# EasyEDA Pro project ProPrj_通用工程PCB-Update-V3.1_2025-07-16.epro, board [PCB]Advance_Board
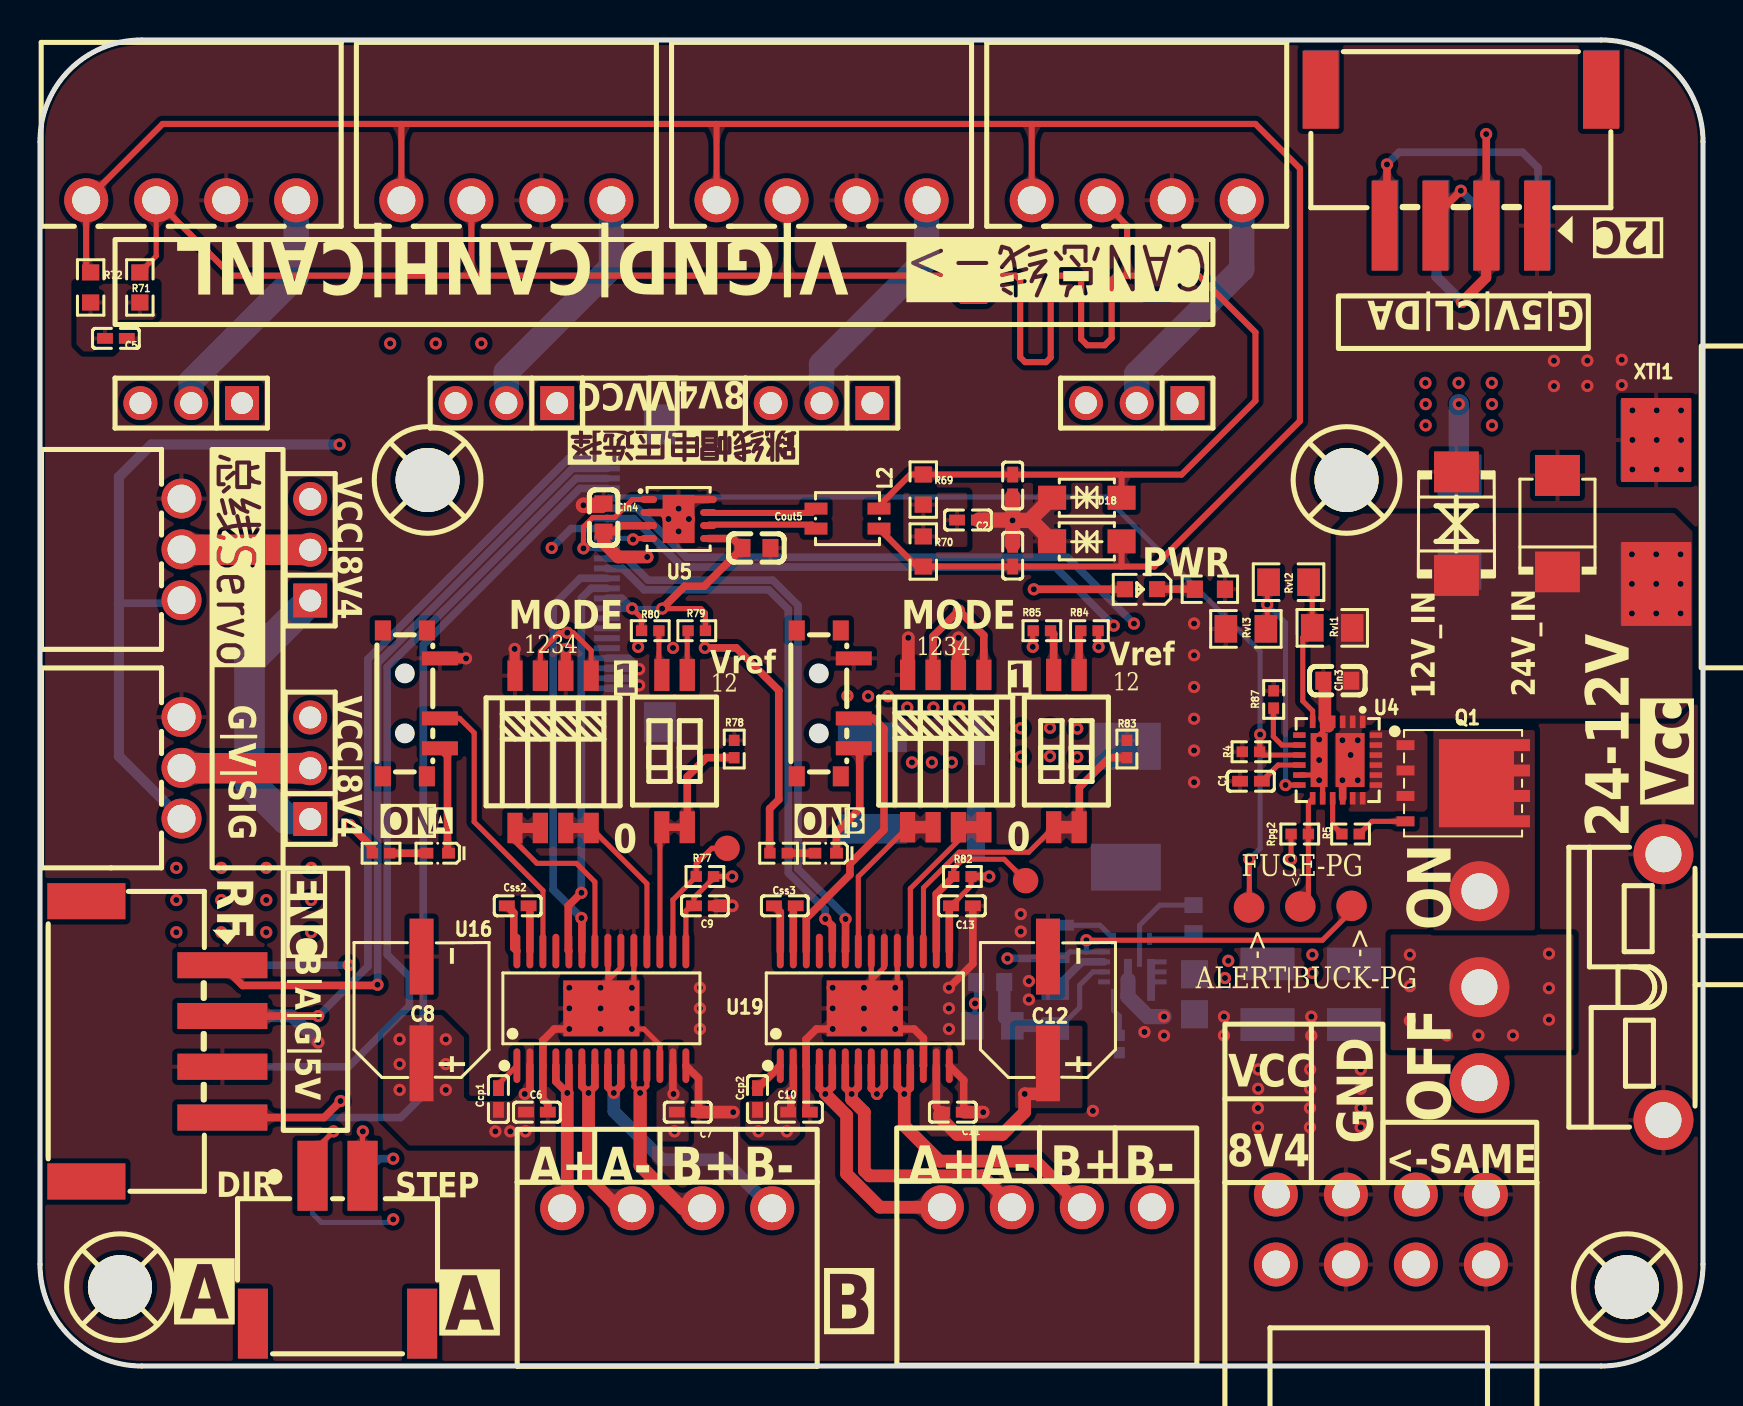
[diagram p9: board, top side]
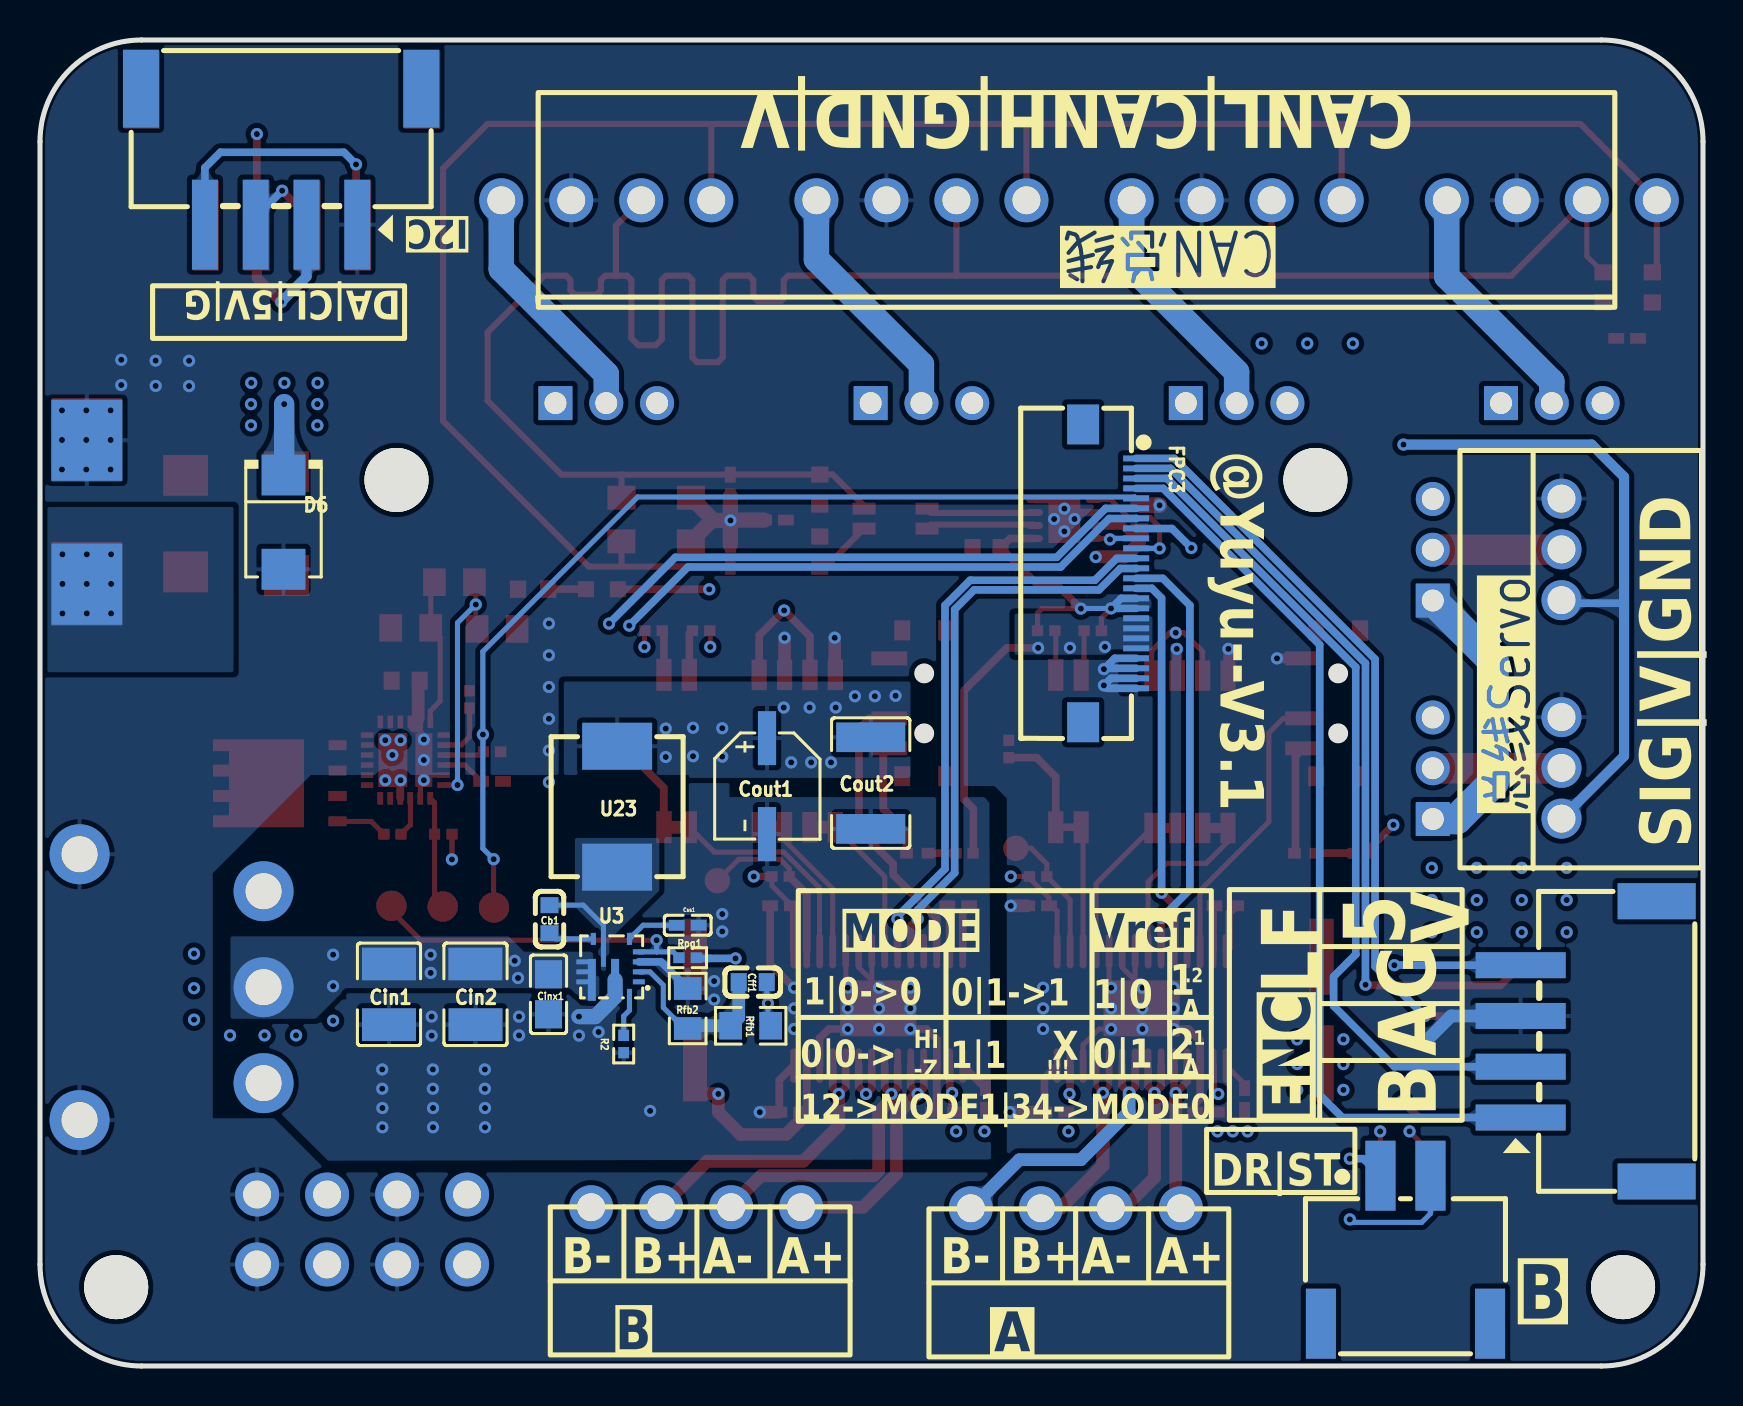
[diagram p10: board, bottom side, seen from below]

Outline 83.15 x 66.34 mm; copper layers: Top Layer, SIG, PWR, Bottom Layer. Coordinates in mm from the lower left corner of the outline.
Outline path: 0,61.26 0,5.08 arc(1.49,1.49) 5.08,0 78.07,0 arc(81.66,1.49) 83.15,5.08 83.15,61.26 arc(81.66,64.85) 78.07,66.34 5.08,66.34 arc(1.49,64.85) 0,61.26
Stack: Top Layer 0.035mm 外层铜厚1oz / Dielectric1 0.2104mm 7628 RC49% 8.6mil / SIG 0.0152mm 内层铜厚 / Dielectric2 1.065mm 1.1mm H/HOZ Copper / PWR 0.0152mm 内层铜厚 / Dielectric3 0.2104mm 7628 RC49% 8.6mil / Bottom Layer 0.035mm 外层铜厚1oz

## Design rules (mm)
net $1N15372: DP2
net $1N15395: DP2
net $1N15376: DP1
net $1N15353: DP1
template: 自定义配置
spacing copperThickness1oz (default): track to track 0.102, other pairs 0.152 to 0.3
spacing copperThickness2oz: track to track 0.203, other pairs 0.152 to 0.3
track width copperThickness1oz (default): min 0.127, default 0.254, max 2.54
track width copperThickness2oz: min 0.203, default 0.254, max 2.54
differential pair differentialPair (default): width min 0.127, default 0.254, max 2.54; gap min 0.152, default 0.152
via viaSize (default): diameter min 0.5, default 0.61, max 10; hole min 0.3, default 0.305, max 6.3
net VCC uses copperRegion1
net $1N2774 uses copperRegion1
net BAT_VCC uses copperRegion1
net 5V uses copperRegion1
net 3V3 uses copperRegion1
net $1N5506 uses copperRegion1
net FUSED_VCC uses copperRegion1

## Placement (name value [footprint] x y rotation side)
C1  2.2nF  [C0402]  60.55 29.25 180 top
C2  4.7nF  [C0402]  46.4 42.32 0 top
C3  100pF  [C0402]  48.63 44.05 90 top
C4  100pF  [C0402]  48.63 40.54 90 top
C5  4.7nF  [C0402]  3.8 51.41 0 top
C6  10nF  [C0402]  24.84 12.7 0 top
C7  10nF  [C0402]  32.38 12.7 180 top
C8  100uF  [CAP-SMD_BD6.3-L6.6-W6.6-FD-1]  19.08 17.81 90 top
C9  470nF  [C0402]  33.24 23.02 0 top
C10  10nF  [C0402]  37.95 12.7 0 top
C11  10nF  [C0402]  45.64 12.7 180 top
C12  100uF  [CAP-SMD_BD6.3-L6.6-W6.6-FD-1]  50.4 17.81 90 top
C13  470nF  [C0402]  46.1 23.02 0 top
Cb1  100nF  [C0603]  57.67 22.36 90 bottom
Ccp1  220nF  [C0402]  22.92 13.36 270 top
Ccp2  220nF  [C0402]  35.88 13.36 270 top
Cff1  100pF  [C0603]  47.51 19.21 180 bottom
Cin1  10uF  [C1210]  65.7 18.6 270 bottom
Cin2  10uF  [C1210]  61.38 18.6 270 bottom
Cin3  100nF  [C0603]  64.87 34.28 0 top
Cin4  100nF  [C0603]  28.18 42.44 90 top
Cinx1  100nF  [C0805]  57.72 18.6 270 bottom
CN3  XDWF-2500-04P  [CONN-SMD_4P-P2.54_MXXH-2.54-04P-WT1-0-A]  5.72 16.24 270 top
CN9  KF2EDGR-3.5-4P  [CONN-TH_4P-P3.50_KF2EDGR-3.5-4P]  54.84 58.32 180 top
CN10  KF2EDGR-3.5-4P  [CONN-TH_4P-P3.50_KF2EDGR-3.5-4P]  39.08 58.32 180 top
CN11  KF2EDGR-3.5-4P  [CONN-TH_4P-P3.50_KF2EDGR-3.5-4P]  23.32 58.32 180 top
CN12  KF2EDGR-3.5-4P  [CONN-TH_4P-P3.50_KF2EDGR-3.5-4P]  7.56 58.32 180 top
CN15  5264-3AW  [CONN-TH_5264-3AW]  6.38 29.92 270 top
CN16  5264-3AW  [CONN-TH_5264-3AW]  6.38 40.85 270 top
CN17  XDWF-2500-04P  [CONN-SMD_4P-P2.54_MXXH-2.54-04P-WT1-0-A]  71.04 60.45 180 top
CN18  XDWF-2500-04P  [CONN-SMD_4P-P2.54_MXXH-2.54-04P-WT1-0-A]  71.09 60.5 0 bottom
CN19  KF2EDGR-3.5-4P  [CONN-TH_4P-P3.50_KF2EDGR-3.5-4P]  31.36 7.89 0 top
CN20  KF2EDGR-3.5-4P  [CONN-TH_4P-P3.50_KF2EDGR-3.5-4P]  50.34 7.94 0 top
CN21  XDWF-2500-04P  [CONN-SMD_4P-P2.54_MXXH-2.54-04P-WT1-0-A]  5.72 16.24 90 bottom
CN22  ZX-XH2.54-2PWT  [CONN-SMD_2P-P2.54_MEGASTAR_ZX-XH2.54-2PWT]  14.88 5.82 0 top
CN23  ZX-XH2.54-2PWT  [CONN-SMD_2P-P2.54_MEGASTAR_ZX-XH2.54-2PWT]  14.88 5.82 180 bottom
CN24  KF2EDGKRH-3.5-2*4P  [CONN-TH_8P-P3.50_KEFA_KF2EDGKRH-3.5-2-4P]  67.05 6.83 0 top
Cout1  33uF  [CAP-SMD_BD5.0-L5.3-W5.3-LS6.3-FD]  46.8 29.01 270 bottom
Cout2  15uF  [C1812]  41.61 29.16 90 bottom
Cout5  100nF  [C0603]  35.82 40.92 180 top
Css1  22nF  [C0402]  50.77 22.05 180 bottom
Css2  22nF  [C0402]  23.88 23.02 0 top
Css3  22nF  [C0402]  37.24 23.02 0 top
D4  SMBJ15CA  [SMB_L4.6-W3.6-LS5.4-BI]  70.82 42.14 270 top
D5  SMBJ26CA  [SMB_L4.6-W3.6-LS5.4-RD]  75.87 42.14 90 top
D6  SMBJ9.0A  [SMB_L4.6-W3.6-LS5.3-RD]  70.97 42.22 270 bottom
D18  SMF5.0CA  [SOD-123FL_L2.7-W1.8-LS3.8-BI]  52.34 43.44 180 top
D19  SMF5.0CA  [SOD-123FL_L2.7-W1.8-LS3.8-BI]  52.34 41.25 0 top
FPC3  AFC01-S24FCA-00  [FPC-SMD_24P-P0.50_AFC01-S24FCA-00]  29.67 39.65 270 bottom
H3  -  [HDR-TH_3P-P2.54-V-M]  13.51 29.9 90 top
H4  -  [HDR-TH_3P-P2.54-V-M]  13.51 40.83 90 top
H5  -  [HDR-TH_3P-P2.54-V-M]  54.84 48.17 180 top
H6  -  [HDR-TH_3P-P2.54-V-M]  39.08 48.17 180 top
H7  -  [HDR-TH_3P-P2.54-V-M]  23.32 48.17 180 top
H8  -  [HDR-TH_3P-P2.54-V-M]  7.56 48.17 180 top
L2  ACT1210-510-2P-TL00  [FILTER-SMD_4P-L3.2-W2.5-BL_ACT1210]  40.37 42.39 270 top
LED1  LTST-C191KSKT  [LED0603-RD-YELLOW]  55.05 38.86 180 top
LED2  -  [LED_0402]  19.89 25.65 180 top
LED3  -  [LED_0402]  39.29 25.65 180 top
NOREF  -  [Pad_e1979]  80.81 46.31 0 top
NOREF#2  -  [Pad_e1977]  80.81 39.11 0 top
Q1  BSC0702LS-HXY  [TDSON-8_L5.9-W5.2-P1.27-BL]  70.05 29.15 270 top
R2  52.3kΩ  [R0402]  53.97 16.11 270 bottom
R4  1kΩ  [R0402]  60.55 30.73 0 top
R5  1K  [R0402]  65.53 26.61 0 top
R67  10K  [R0603]  58.49 38.86 0 top
R69  60R  [R0603]  44.16 43.84 90 top
R70  60R  [R0603]  44.16 40.75 90 top
R71  60R  [R0603]  4.99 53.96 90 top
R72  60R  [R0603]  2.53 53.96 270 top
R77  10K  [R0402]  33.24 24.49 0 top
R78  28K  [R0402]  34.71 30.86 270 top
R79  5K  [R0402]  32.84 36.79 0 top
R80  28K  [R0402]  30.51 36.79 0 top
R81  10K  [R0402]  17.05 25.65 0 top
R82  10K  [R0402]  46.12 24.49 0 top
R83  28K  [R0402]  54.34 30.86 270 top
R84  5K  [R0402]  52.47 36.79 0 top
R85  28K  [R0402]  50.09 36.79 0 top
R86  10K  [R0402]  36.93 25.65 0 top
R87  105Ω  [R0402]  61.68 33.34 270 top
Rfb1  130K  [R0805]  47.62 17.02 0 bottom
Rfb2  10K  [R0805]  50.77 17.88 270 bottom
Rpg1  100kΩ  [R0402]  50.77 20.42 0 bottom
Rpg2  100kΩ  [R0402]  62.99 26.61 180 top
Rvl1  1M  [R0805]  64.61 36.93 180 top
Rvl2  41.2K  [R0805]  62.43 39.21 0 top
Rvl3  84.5K  [R0805]  60.29 36.88 0 top
SCREW1  -  [M3螺丝]  65.33 44.32 0 top
SCREW2  -  [M3螺丝]  19.38 44.32 0 top
SCREW3  -  [M3螺丝]  79.34 3.95 0 top
SCREW4  -  [M3螺丝]  4 3.95 0 top
SW1  SS-12D11G5R  [SW-TH_SS-12D11G5R]  76.57 18.95 270 top
SW2  DSHP02TS-S  [SW-SMD_DSHP02TS-S]  31.73 30.76 0 top
SW3  DSHP02TS-S  [SW-SMD_DSHP02TS-S]  51.32 30.76 0 top
TP1  -  [Test-Point-0.5mm#3]  65.58 23.02 180 bottom
TP2  -  [Test-Point-0.5mm#2]  60.45 22.94 0 top
TP3  -  [Test-Point-0.5mm#2]  63.02 22.99 90 top
TP4  -  [Test-Point-0.5mm]  34.35 25.9 0 top
TP5  -  [Test-Point-0.5mm]  49.28 24.28 0 top
U3  TPS56A37RPAR  [VQFN-HR-10_L3.0-W3.0_TI_RPA]  54.52 19.97 90 bottom
U4  TPS259830LNRGER  [VQFN-24_L4.0-W4.0-P0.50-TL-EP_TI_RGE]  64.88 30.31 270 top
U5  TCAN1044AVDRBRQ1  [TDFN-8_L3.0-W3.0-P0.65-BL-EP]  31.93 42.37 270 top
U16  DRV8424PWPR  [HTSSOP-28_L9.7-W4.4-P0.65-LS6.4-BL-EP3.8]  28.07 17.89 0 top
U17  DSHP04TSGER  [SW-SMD_8P-L6.7-W5.4-P1.27-LS8.4]  25.65 30.73 180 top
U18  MSS12C02LS-BB2.0  [SW-SMD_MSS12C02LS-HB2.0-1]  18.57 33.15 90 top
U19  DRV8424PWPR  [HTSSOP-28_L9.7-W4.4-P0.65-LS6.4-BL-EP3.8]  41.24 17.89 0 top
U20  DSHP04TSGER  [SW-SMD_8P-L6.7-W5.4-P1.27-LS8.4]  45.29 30.76 180 top
U21  MSS12C02LS-BB2.0  [SW-SMD_MSS12C02LS-HB2.0-1]  39.27 33.15 90 top
U23  4.7uH  [IND-SMD_L7.0-W6.6_APH0630]  54.29 27.98 90 bottom
XTI1  -  [XT60PW]  79.06 42.73 0 top

## Footprints (pads in the part's own frame, mm; a bottom-side part is the same pattern mirrored in y, then rotated)
C0402
  rect 0.79x0.54 smd: 1(-0.545,0) 2(0.545,0)
C0603
  rect 0.8x0.9 smd: 1(-0.7,0) 2(0.7,0)
C0805
  rect 1.41x1.35 smd: 1(-1,0) 2(1,0)
C1210
  rect 1.635x2.7 smd: 1(-1.518,0) 2(1.518,0)
C1812
  rect 1.485x3.456 smd: 1(-2.292,0) 2(2.292,0)
CAP-SMD_BD5.0-L5.3-W5.3-LS6.3-FD
  rect 2.7x0.91 smd: 1(-2.4,0) 2(2.4,0)
CAP-SMD_BD6.3-L6.6-W6.6-FD-1
  rect 3.8x1.2 smd: 1(-2.67,0) 2(2.67,0)
CONN-SMD_2P-P2.54_MEGASTAR_ZX-XH2.54-2PWT
  rect 1.5x3.5 smd: 1(-1.25,3.7) 2(1.25,3.7) 3(-4.23,-3.7) 4(4.23,-3.7)
CONN-SMD_4P-P2.54_MXXH-2.54-04P-WT1-0-A
  rect 1.3x4.5 smd: 1(-3.809,3.4) 2(-1.27,3.4) 3(1.27,3.4) 4(3.81,3.4)
  rect 1.8x3.9 smd: 5(7.01,-3.4) 6(-7.01,-3.4)
CONN-TH_4P-P3.50_KF2EDGR-3.5-4P
  round 2.2 hole 1.4: 1(-5.25,0) 2(-1.75,0) 3(1.75,0) 4(5.25,0)
CONN-TH_8P-P3.50_KEFA_KF2EDGKRH-3.5-2-4P
  round 2.2 hole 1.4: 1(-5.25,-1.75) 2(-5.25,1.75) 3(-1.75,-1.75) 4(-1.75,1.75) 5(1.75,-1.75) 6(1.75,1.75) 7(5.25,-1.75) 8(5.25,1.75)
CONN-TH_5264-3AW
  round 2 hole 1.4: 1(2.54,0.7) 2(0,0.7) 3(-2.54,0.7)
FILTER-SMD_4P-L3.2-W2.5-BL_ACT1210
  rect 0.6x1.15 smd: 1(-0.5,-1.575) 2(0.5,-1.575) 3(0.5,1.575) 4(-0.5,1.575)
FPC-SMD_24P-P0.50_AFC01-S24FCA-00
  rect 0.3x1.3 smd: 1(-5.75,1.325) 2(-5.25,1.325) 3(-4.75,1.325) 4(-4.25,1.325) 5(-3.75,1.325) 6(-3.25,1.325) 7(-2.75,1.325) 8(-2.25,1.325) 9(-1.75,1.325) 10(-1.25,1.325) 11(-0.75,1.325) 12(-0.25,1.325) 13(0.25,1.325) 14(0.75,1.325) 15(1.25,1.325) 16(1.75,1.325) 17(2.25,1.325) 18(2.75,1.325) 19(3.25,1.325) 20(3.75,1.325) 21(4.25,1.325) 22(4.75,1.325) 23(5.25,1.325) 24(5.75,1.325)
  rect 2x1.6 smd: 25(7.449,-1.325) 26(-7.45,-1.325)
HDR-TH_3P-P2.54-V-M
  rect 1.7x1.7 hole 1.1: 1(-2.54,0)
  round 1.7 hole 1.1: 2(0,0) 3(2.54,0)
HTSSOP-28_L9.7-W4.4-P0.65-LS6.4-BL-EP3.8
  oval 0.343x1.732 smd: 1(-4.225,-2.866) 2(-3.575,-2.866) 3(-2.925,-2.866) 4(-2.275,-2.866) 5(-1.625,-2.866) 6(-0.975,-2.866) 7(-0.325,-2.866) 8(0.325,-2.866) 9(0.975,-2.866) 10(1.625,-2.866) 11(2.275,-2.866) 12(2.925,-2.866) 13(3.575,-2.866) 14(4.225,-2.866) 15(4.225,2.866) 16(3.575,2.866) 17(2.925,2.866) 18(2.275,2.866) 19(1.625,2.866) 20(0.975,2.866) 21(0.325,2.866) 22(-0.325,2.866) 23(-0.975,2.866) 24(-1.625,2.866) 25(-2.275,2.866) 26(-2.925,2.866) 27(-3.575,2.866) 28(-4.225,2.866)
  rect 3.81x2.8 smd: 29(0,0)
IND-SMD_L7.0-W6.6_APH0630
  rect 2.35x3.5 smd: 1(-3.025,0) 2(3.025,0)
LED0603-RD-YELLOW
  rect 0.8x0.8 smd: 1(-0.799,-0.004) 2(0.799,0.004)
LED_0402
  rect 0.637x0.541 smd: 1(-0.538,0) 2(0.538,0)
M3螺丝
  round 3.2 hole 3.2: 1(0,0)
Pad_e1977
  rect 3.556x4.064 smd far side: 1(0,0)
Pad_e1979
  rect 3.556x4.064 smd far side: 1(0,0)
R0402
  rect 0.566x0.54 smd: 1(-0.433,0) 2(0.433,0)
R0603
  rect 0.806x0.864 smd: 1(-0.753,0) 2(0.753,0)
R0805
  rect 1.133x1.377 smd: 1(-1,0) 2(1,0)
SMB_L4.6-W3.6-LS5.3-RD
  rect 2.047x2.192 smd: 1(-2.361,0) 2(2.361,0)
SMB_L4.6-W3.6-LS5.4-BI
  rect 2.047x2.241 smd: 1(-2.591,0) 2(2.591,0)
SMB_L4.6-W3.6-LS5.4-RD
  rect 2.047x2.241 smd: 1(-2.413,0) 2(2.413,0)
SOD-123FL_L2.7-W1.8-LS3.8-BI
  rect 1.4x1.2 smd: 1(-1.735,0) 2(1.735,0)
SW-SMD_8P-L6.7-W5.4-P1.27-LS8.4
  rect 0.762x1.524 smd: 1(-1.905,-3.81) 2(-0.635,-3.81) 3(0.635,-3.81) 4(1.905,-3.81) 5(1.905,3.81) 6(0.635,3.81) 7(-0.635,3.81) 8(-1.905,3.81)
SW-SMD_DSHP02TS-S
  rect 0.762x1.6 smd: 1(0.635,3.81) 2(-0.635,3.81) 3(-0.635,-3.81) 4(0.635,-3.81)
SW-SMD_MSS12C02LS-HB2.0-1
  rect 0.7x1.8 smd: 1(-2.25,-1.425) 2(-0.75,-1.425) 3(2.25,-1.425)
  rect 1x0.8 smd: 4(-3.65,1.425) 4(-3.65,-0.775) 4(3.65,1.425) 4(3.65,-0.775)
SW-TH_SS-12D11G5R
  round 3 hole 1.8: 1(-4.8,-4.6) 2(0,-4.6) 3(4.8,-4.6) 4(6.65,4.6) 5(-6.65,4.6)
TDFN-8_L3.0-W3.0-P0.65-BL-EP
  oval 0.35x0.84 smd: 1(-0.975,-1.495) 2(-0.325,-1.495) 3(0.325,-1.495) 4(0.975,-1.495) 5(0.975,1.495) 6(0.325,1.495) 7(-0.325,1.495) 8(-0.975,1.495)
  rect 2.4x1.6 smd: 9(0,0)
TDSON-8_L5.9-W5.2-P1.27-BL
  rect 0.5x0.9 smd: 1(-1.905,-1.775) 2(-0.635,-1.775) 3(0.635,-1.775) 4(1.905,-1.775)
  custom 4.41x4.55 smd: 5(0,1.775)
Test-Point-0.5mm
  round 1.27 smd: 1(0,0)
Test-Point-0.5mm#2
  round 1.524 smd: 1(0,0)
Test-Point-0.5mm#3
  round 1.524 smd far side: 1(0,0)
VQFN-24_L4.0-W4.0-P0.50-TL-EP_TI_RGE
  rect 0.625x0.28 smd: 1(-1.913,1.25) 2(-1.913,0.75) 3(-1.913,0.25) 4(-1.913,-0.25) 5(-1.913,-0.75) 6(-1.913,-1.25) 13(1.913,-1.25) 14(1.913,-0.75) 15(1.913,-0.25) 16(1.913,0.25) 17(1.913,0.75) 18(1.913,1.25)
  rect 0.28x0.625 smd: 7(-1.25,-1.913) 8(-0.75,-1.913) 9(-0.25,-1.913) 10(0.25,-1.913) 11(0.75,-1.913) 12(1.25,-1.913) 19(1.25,1.913) 20(0.75,1.913) 21(0.25,1.913) 22(-0.25,1.913) 23(-0.75,1.913) 24(-1.25,1.913)
  rect 2.7x1.45 smd: 25(0,0.625)
  rect 2.7x0.85 smd: 26(0,-0.925)
VQFN-HR-10_L3.0-W3.0_TI_RPA
  rect 0.25x0.6 smd: 1(-0.75,-1.317) 2(-0.25,-1.317) 3(0.25,-1.317) 4(0.75,-1.317)
  rect 0.6x0.25 smd: 5(1.4,-0.848) 7(1.4,0.953) 10(-1.4,-0.848)
  rect 1.7x0.25 smd: 6(0.85,0.453)
  custom 2.1x0.97 smd: 8(-0.65,1.317)
  rect 2.1x0.4 smd: 9(-0.65,-0.128)
XT60PW
  custom 3.5x4.2 smd: 1(1.75,-3.6) 2(1.75,3.6)

## Nets
As in the schematic, except:
GND: C1.2 C2.2 C3.1 C4.2 C5.2 C6.2 C7.1 C8.2 C9.2 C10.2 C11.1 C12.2 C13.2 Cin1.2 Cin2.2 Cin3.1 Cin4.2 Cinx1.2 CN3.3 CN9.2 CN10.2 CN11.2 CN12.2 CN15.3 CN16.3 CN17.1 CN18.1 CN21.3 CN24.3 CN24.4 CN24.7 CN24.8 Cout1.2 Cout2.1 Cout5.1 Css1.2 D4.1 D5.2 D6.2 D18.2 D19.1 FPC3.21 FPC3.22 FPC3.23 FPC3.24 NOREF.1 R2.2 R4.1 R67.2 R78.1 R83.1 R87.1 Rfb2.1 Rvl3.1 SW1.4 SW1.5 U3.3 U3.9 U4.4 U4.5 U4.11 U4.14 U4.26 U5.2 U5.8 U5.9 U16.3 U16.12 U16.14 U16.19 U16.20 U16.21 U16.29 U17.2 U17.4 U18.3 U19.3 U19.12 U19.14 U19.19 U19.20 U19.21 U19.29 U20.2 U20.4 U21.3 XTI1.2
BAT_VCC: Cin3.2 D4.2 D5.1 NOREF#2.1 Rvl1.1 U4.1 U4.2 U4.3 U4.16 U4.25 XTI1.1

Pads without a net: CN3 5 6; CN17 5 6; CN18 5 6; CN21 5 6; CN22 3 4; CN23 3 4; FPC3 25 26; SCREW1 1; SCREW2 1; SCREW3 1; SCREW4 1; SW1 3; U3 1; U4 7; U16 25; U18 4; U19 25; U21 4

## Via types
v1: diameter 0.61, hole 0.305, Top Layer to Bottom Layer, 222 vias

## Routing (per net, layer and track width the routed paths; a pad name or vN(x,y) marks a point on that pad's centre or on a via; arc(x,y) is an arc through that point)
3V3: length 58.8
  Top Layer w0.254: R85.1 49.64,36.76 v1(49.64,35.98) ; v1(29.6,37.9) 30.08,37.42 R80.1 ; v1(52.93,35.98) 52.93,36.76 R84.2 ; Rpg2.2 v1(62.55,25.34) ; R79.2 33.27,37.67 33.05,37.89 v1(31.11,37.89)
  Top Layer w0.381: U5.5 34.65,41.4 Cout5.2 33.21,39.01 32.23,39.01 v1(31.11,37.89)
  SIG w0.508: v1(62.55,25.34) 61.74,26.16 57.89,26.16 55.81,28.23 55.81,33.09 v1(52.93,35.98) v1(49.64,35.98) 47.11,38.51 40.08,38.51 39.46,37.89 v1(31.11,37.89)
  Bottom Layer w0.254: v1(31.11,37.89) 31.1,37.9 v1(29.6,37.9)
  Bottom Layer w0.381: 29.6,37.9 29.1,38.4 FPC3.15 ; 29.6,37.9 FPC3.16 ; 29.6,37.9 v1(29.6,37.9)
5V: length 182.6
  Top Layer w0.381: Cin4.1 28.72,41.74 29.01,42.03 30.42,42.03 U5.3 ; v1(15.48,27.07) 16.62,25.94 R81.1 ; v1(15.03,13.26) 14.2,12.43 CN3.4 ; CN17.2 72.31,61.63 v1(72.31,61.63) ; R86.1 36.48,25.67 36.48,27.88 36.94,28.33 36.94,33.8 34.81,35.92 v1(33.24,35.92)
  Top Layer w0.508: v1(71.09,53.23) 72.31,54.44 72.31,57.04 CN17.2
  Top Layer w0.635: v1(30.36,40.47) 28.9,40.47 28.18,41.19 Cin4.1
  SIG w0.381: v1(31.65,35.92) 32.31,36.58 35.07,36.58 37.55,34.1 37.55,29.35 46.1,20.8 46.1,17.03 46.48,16.65 47.99,16.65 48.37,17.03 v1(48.37,20.39) ; v1(72.31,61.63) 67.4,61.63 63.71,57.94 63.71,51.27 58.03,45.59 31.32,45.59 30.36,44.63 v1(30.36,40.47) 30.36,36.43 v1(29.9,35.98)
  SIG w0.762: v1(29.9,35.98) 27.98,37.9 17.2,37.9 15.47,36.17 15.47,13.7 v1(15.03,13.26)
  Bottom Layer w0.381: CN21.4 v1(15.43,20.05) ; v1(48.37,20.39) 50.3,20.39 Rpg1.1
  Bottom Layer w0.508: v1(71.09,53.23) 69.82,54.5 CN18.2
8V4: length 112.5
  Top Layer w0.381: LED1.2 v1(49.69,38.86)
  SIG w0.254: v1(46.75,18.14) 46.75,22.11 49.04,24.39 v1(49.04,30.48)
  SIG w0.762: CN24.5 68.85,5.03 68.85,1.82
  SIG w0.838: v1(69.28,47.06) 70.35,48.12 ; 70.35,48.12 70.93,48.12 ; 70.35,48.12 70.33,48.12 ; v1(72.6,47.06) v1(72.6,48.12) 72.59,48.13 v1(72.59,49.18) ; 70.33,48.12 v1(69.27,49.18) ; 70.33,48.12 v1(69.28,48.12) ; 70.93,48.13 v1(70.93,49.18)
  SIG w1.524: CN24.1 65.05,1.82 71.88,1.82 76.67,6.6 76.67,44.92 73.47,48.12 v1(72.6,48.12) v1(70.94,48.12)
  Bottom Layer w0.254: Rfb1.1 46.75,17.16 v1(46.75,18.14) 46.81,18.2 46.81,19.21
  Bottom Layer w1.016: 70.97,44.58 70.94,44.61 v1(70.94,48.12)
  Bottom Layer w1.524: H4.1 10.47,35.26 10.47,29.2 12.31,27.36 H3.1
  vias: v1(40.37,33.53) v1(41.41,33.51) v1(42.4,33.51) v1(43.36,32.94) v1(43.6,30.2) v1(44.59,30.2) v1(44.67,32.94) v1(45.59,30.2) v1(45.96,32.94) v1(49.04,31.91) v1(50.5,31.93) v1(50.5,30.51) v1(51.86,31.89) v1(51.86,30.47)
DVDD1: length 26.7
  Top Layer w0.254: U17.3 25.02,35.75 25.96,36.68 v1(26.36,36.68) 26.67,36.68 27.56,35.79 U17.1 ; v1(34.61,24.49) R77.2 33.68,24.41 32.7,23.43 C9.1 32.55,23.02 32.3,22.77 U16.15
  SIG w0.254: v1(34.61,24.49) 34.61,28.44 v1(26.36,36.68)
DVDD2: length 27
  Top Layer w0.254: 45.55,23.02 46.55,24.02 R82.2
  Top Layer w0.381: U19.15 45.46,22.93 45.55,23.02 ; U20.1 47.19,36.55 v1(45.94,37.8) 44.65,36.5 U20.3 ; R82.2 v1(47.46,24.49)
  SIG w0.381: v1(45.94,37.8) 48.02,35.72 48.02,25.05 v1(47.46,24.49)
GND: length 101.9
  Top Layer w0.254: v1(42.76,18.92) 42.86,19.03 U19.19 ; U16.21 28.4,19.29 29.05,19.94 U16.20 ; 64.13,31.77 64.41,32.05 64.59,32.23 U4.4 ; 64.13,31.77 64.15,31.75 63.96,31.55 v1(63.96,31.34) ; 64.13,31.77 64.13,32.01 ; U16.19 29.69,19.03 v1(29.59,18.92) ; U19.21 41.56,19.29 42.21,19.94 42.21,20.76 ; U16.12 31,16.06 30.2,16.86 v1(29.59,16.86) ; U4.11 63.7,29.56 v1(63.96,29.31) 64.13,29.13 U4.14
  Top Layer w0.381: v1(31.43,42.37) 31.1,42.7 U5.2 ; C6.2 25.39,13.12 25.15,13.36 U16.3 25.15,16.29 25.72,16.86 v1(26.46,16.86) ; U5.8 32.39,43.35 v1(31.93,42.89) ; C7.1 32.93,14.39 U16.14 ; U19.12 44.17,15.04 44.17,16.39 43.71,16.86 v1(42.76,16.86) ; v1(39.63,16.86) 38.82,16.86 38.3,16.34 38.3,15.04 U19.3 38.31,12.88 C10.2 ; v1(45.45,18.92) 46.64,20.12 C13.2 ; C11.1 46.19,14.3 U19.14
  Top Layer w0.508: U17.4 23.73,34.55 v1(23.73,35.87) ; U18.3 v1(21.3,35.4) ; v1(26.31,35.87) 26.29,35.85 U17.2
  Top Layer w0.635: U20.4 43.42,34.61 v1(43.42,36.43) ; C7.1 v1(34.66,12.7) ; 64.41,32.01 64.41,32.23 64.24,32.4 64.24,34.21 Cin3.1 ; C11.1 v1(47.16,12.7) ; v1(45.92,36.43) U20.2 ; C9.2 v1(34.61,23.02)
  Top Layer w0.762: C2.2 48.61,42.32 v1(48.63,42.3) ; v1(48.63,42.3) 48.63,42.31 48.63,43.5 ; v1(48.63,42.3) 48.63,42.29 C4.2 ; v1(48.63,42.3) 49.47,42.3 ; v1(27.17,43.06) 27.18,43.06 28.1,43.06 Cin4.2 ; 49.47,42.3 49.56,42.3 D19.1 ; 49.47,42.3 D18.2
  SIG w0.508: v1(33,18.92) v1(29.59,18.92) ; v1(45.45,16.86) v1(42.76,16.86) ; v1(45.45,17.89) v1(42.76,17.89) ; v1(45.45,18.92) v1(42.76,18.92) ; v1(33,17.89) v1(29.59,17.89) ; v1(33,16.86) v1(29.59,16.86)
  Bottom Layer w0.381: Rfb2.1 52.1,20.22 53.21,20.22 ; FPC3.23 29.6,34.4 v1(29.96,34.05) 29.81,33.9 FPC3.24 ; 29.91,34.9 29.41,35.4 FPC3.21 ; 29.91,34.9 FPC3.22 ; 29.91,34.9 v1(29.96,34.86)
  Bottom Layer w0.635: CN21.3 12.59,17.51 v1(13.92,16.19)
  Bottom Layer w0.762: U3.9 54.4,18.47 55.39,17.48 v1(56.2,17.48)
  vias: v1(26.46,18.92) v1(26.46,17.89) v1(28.03,18.92) v1(28.03,17.89) v1(28.03,16.86) v1(31.93,41.75) v1(32.44,42.37) v1(39.63,18.92) v1(39.63,17.89) v1(41.2,18.92) v1(41.2,17.89) v1(41.2,16.86) v1(49.04,22.61) v1(49.04,21.74) v1(49.44,19.26) v1(49.44,18.33) v1(52.65,12.76) v1(55.22,16.71) v1(56.2,16.53) v1(57.7,37.14) v1(57.7,35.56) v1(57.7,33.97) v1(57.7,32.38) v1(57.7,30.79) v1(57.7,29.2) v1(59.2,17.48) v1(59.2,16.54) v1(60.91,14.84) v1(60.91,13.87) v1(60.9,12.91) v1(60.9,11.94) v1(63.5,12.91) v1(63.5,11.94) v1(63.57,17.48) v1(63.57,16.53) v1(63.51,14.84) v1(63.51,13.87) v1(63.96,30.31) v1(66.04,14.84) v1(66.04,13.87) v1(66.03,12.91) v1(66.03,11.94) v1(75.7,50.29) v1(75.7,49.02) v1(77.37,50.3) v1(77.37,49.03) v1(79.09,50.34) v1(79.09,49.07) v1(79.62,47.81) v1(79.62,46.33) v1(79.62,44.85) v1(80.84,47.81) v1(80.84,46.33) v1(80.84,44.85) v1(82.05,47.81) v1(82.05,46.33) v1(82.05,44.85)
VCC: length 137.2
  Top Layer w0.381: U19.2 37.66,13.78 v1(37.55,13.66) 37.55,12.84 C10.1 ; U16.2 24.5,13.87 v1(24.24,13.61) ; U16.13 31.65,13.64 v1(31.68,13.61) ; U19.13 44.81,12.98 C11.2
  Top Layer w0.635: 50.36,13.62 49.24,13.62 v1(49.23,13.61) 49.23,12.7 48.12,11.59 45.84,11.59 44.98,12.45 44.98,12.59 C11.2
  SIG w0.254: v1(59.25,19.41) 60.37,18.29 60.37,15.9 58.08,13.62 50.36,13.62
  SIG w0.381: v1(9.06,24.92) 9.64,24.92 10.27,25.55 10.9,24.92 v1(11.31,24.92) ; 10.27,24.52 7.22,24.52 v1(6.82,24.92) ; 10.27,24.52 v1(9.06,23.31) ; 10.27,24.52 13.16,24.52 v1(13.56,24.92)
  SIG w0.762: v1(11.31,21.7) 10.27,22.74 10.27,22.91 ; 10.27,22.91 10.27,25.55 ; 10.27,22.91 v1(9.06,21.7) ; 13.51,43.37 13.4,43.26 10.27,43.26
  SIG w1.016: v1(19.79,51.16) 20.78,50.16 H7.3 ; v1(17.51,51.16) 8,51.16 5.02,48.17 ; 33.55,51.16 H6.3 ; 33.55,51.16 v1(22.07,51.16) ; 33.55,51.16 49.31,51.16 H5.3
  SIG w1.524: v1(22.07,51.16) v1(19.79,51.16) v1(17.51,51.16) 10.27,44.58 10.27,25.55
  vias: v1(6.82,23.31) v1(6.82,21.7) v1(11.31,23.31) v1(13.56,23.31) v1(13.56,21.7) v1(17.98,16.34) v1(17.98,15.1) v1(17.98,13.81) v1(20.29,16.34) v1(20.29,15.1) v1(20.29,13.81) v1(22.77,11.74) v1(23.51,11.74) v1(24.27,11.74) v1(31.73,11.74) v1(35.93,11.74) v1(37.34,11.74) v1(59.41,20.27) v1(63.62,20.58) v1(63.62,19.67) v1(68.49,20.58) v1(68.49,19) v1(68.49,17.27) v1(70.35,16.54) v1(71.92,16.54) v1(73.65,16.54) v1(75.45,20.63) v1(75.45,18.9) v1(75.45,17.33)
A0-RF_ENC_A: length 39.8
  Top Layer w0.381: v1(13.92,17.51) 9.12,17.51 9.12,17.51
  Bottom Layer w0.381: v1(13.92,17.51) 16.39,19.99 16.39,35.36 26.44,45.4 FPC3.1
A1-RF_ENC_B: length 39.8
  Top Layer w0.381: 9.12,20.05 10.13,19.04 16.84,19.04 v1(16.87,19.08)
  Bottom Layer w0.381: FPC3.2 26.62,44.9 16.88,35.16 16.88,19.08 v1(16.87,19.08)
AOUT+_1: length 8.9
  Top Layer w0.381: U16.4 25.8,14.23 v1(26.36,13.66) 26.44,13.74 U16.5
  Top Layer w0.635: v1(26.36,13.66) 26.36,8.15 CN19.1
AOUT+_2: length 13
  Top Layer w0.381: U19.5 39.61,13.96 v1(39.27,13.61) 38.96,13.91 U19.4
  Top Layer w0.635: v1(39.27,13.61) 40.33,12.55 40.33,9.61 42,7.94 CN20.1
AOUT-_1: length 9.7
  Top Layer w0.381: U16.6 27.09,13.99 v1(27.43,13.66) 27.75,13.98 U16.7
  Top Layer w0.635: v1(27.43,13.66) 27.43,9.42 28.96,7.89 29.26,7.89
AOUT-_2: length 15.4
  Top Layer w0.381: 40.91,15.03 40.91,13.94 v1(40.58,13.61) 40.26,13.93 U19.6
  Top Layer w0.635: CN20.2 48.59,8.03 47.11,9.51 41.47,9.51 41.22,9.77 41.22,12.7 40.58,13.34 v1(40.58,13.61)
B5-STEPA_DIR: length 41.8
  Top Layer w0.254: CN22.1 13.63,10.69 v1(14.67,11.74)
  Top Layer w0.381: U16.24 26.41,20.79 26.41,23.02 v1(27.07,23.67)
  SIG w0.254: v1(27.07,23.67) 24.29,20.9 19.73,20.9 16.08,17.24 16.08,13.2 14.67,11.79 v1(14.67,11.74)
  Bottom Layer w0.381: FPC3.14 27.56,38.9 27.07,38.42 v1(27.07,23.67)
B6-STEPA_STEP: length 41.7
  Top Layer w0.254: v1(16.14,11.74) 16.13,11.72 CN22.2
  Top Layer w0.381: U16.23 27.09,22.39 v1(27.07,22.41)
  SIG w0.254: v1(27.07,22.41) 26.31,22.41 24.44,20.54 19.88,20.54 16.44,17.1 16.44,12.03 v1(16.14,11.74)
  Bottom Layer w0.381: FPC3.13 27.01,39.4 25.65,38.05 25.65,23.83 v1(27.07,22.41)
B7-STEPB_DIR: length 60
  Top Layer w0.381: U19.24 39.61,22.02 v1(39.27,22.36)
  SIG w0.254: v1(17.66,10.37) 33.43,10.37 37.04,13.98 37.04,20.14 v1(39.27,22.36)
  Bottom Layer w0.381: v1(39.27,22.36) 39.27,22.82 37.42,24.67 37.42,37.85 36.44,38.83 30.2,38.83 29.14,39.9 28.35,39.9 FPC3.12 ; CN23.1 16.98,10.37 v1(17.66,10.37)
B9-STEPB_STEP: length 68.8
  Top Layer w0.381: v1(40.28,22.36) 40.28,20.77 U19.23
  SIG w0.254: v1(17.66,7.34) 20.09,9.76 36.2,9.76 38.2,11.77 38.2,20.29 v1(40.28,22.36)
  Bottom Layer w0.254: v1(17.66,7.34) 17.51,7.18 14.07,7.18 13.63,7.62 CN23.2
  Bottom Layer w0.381: FPC3.11 29.31,40.4 30.4,39.31 36.64,39.31 37.9,38.05 37.9,24.87 40.28,22.49 v1(40.28,22.36)
B10-SERVO_SIG_TX: length 50.5
  SIG w0.508: v1(14.98,46.1) 15.89,45.19 15.89,42.96 17.92,40.93 v1(25.58,40.93)
  Bottom Layer w0.381: FPC3.8 28.34,41.9 26.56,41.9 v1(25.58,40.93) ; 3.95,38.16 6.92,38.16 CN16.1
  Bottom Layer w0.508: v1(14.98,46.1) 5.57,46.1 3.95,44.48 3.95,30.51 CN15.1
BAT_VCC: length 0.9
  Top Layer w0.381: v1(65.12,29.31) 65.13,29.29 U4.16
  vias: v1(65.12,31.31) v1(65.53,30.57) v1(65.89,31.31) v1(65.89,29.3) v1(79.59,40.61) v1(79.59,39.13) v1(79.59,37.65) v1(80.81,40.61) v1(80.81,39.13) v1(80.81,37.65) v1(82.03,40.61) v1(82.03,39.13) v1(82.03,37.65)
BOUT+_1: length 10.6
  Top Layer w0.254: U16.11 30.34,14 v1(30.01,13.66) 29.69,13.97 U16.10
  Top Layer w0.66: v1(30.01,13.66) 30.01,10.02 32.14,7.89 CN19.3
BOUT+_2: length 15.3
  Top Layer w0.381: U19.10 42.86,13.96 v1(43.21,13.61) 43.51,13.91 U19.11
  Top Layer w0.635: v1(43.21,13.61) 43.21,12.02 44.98,10.25 49.79,10.25 CN20.3
BOUT-_1: length 13.8
  Top Layer w0.381: U16.9 29.05,14.02 v1(28.69,13.66) 28.4,13.96 U16.8
  Bottom Layer w0.635: CN19.4 34.18,10.32 31.11,10.32 28.69,12.74 v1(28.69,13.66)
BOUT-_2: length 19.6
  Top Layer w0.381: 42.21,15.03 42.21,13.98 v1(41.85,13.61) 41.56,13.89 U19.8
  SIG w1.016: v1(41.85,13.61) 41.85,13 44.63,10.22 53.38,10.22 55.59,8.01 CN20.4
C8-ADVANCE_I2C3_SCL: length 62.1
  Top Layer w0.381: v1(71.04,58.8) 69.77,57.53 CN17.3
  SIG w0.381: v1(71.04,58.8) 70.39,58.8 64.67,53.08 64.67,50.87 54.7,40.9 v1(54.7,37.14)
  Bottom Layer w0.381: v1(54.7,37.14) 51.38,40.46 32.31,40.46 29.87,42.9 FPC3.6 ; v1(71.04,58.8) 72.36,57.48 CN18.3
C9-ADVANCE_I2C3_SDA: length 70.4
  Top Layer w0.381: v1(67.35,60.11) 67.35,57.16 CN17.4
  SIG w0.381: v1(53.69,37.04) 53.69,40.57 64.19,51.07 64.19,56.95 v1(67.35,60.11)
  Bottom Layer w0.381: v1(53.69,37.04) 50.75,39.97 32.11,39.97 29.69,42.4 28.35,42.4 FPC3.7 ; v1(67.35,60.11) 67.96,60.72 74.13,60.72 74.9,59.95 CN18.4
D0-ADVANCE_CAN_RX: length 2.1
  Top Layer w0.254: v1(29.65,41.35) 29.69,41.4 U5.4
  Bottom Layer w0.254: FPC3.9 29.6,41.4 v1(29.65,41.35)
D1-ADVANCE_CAN_TX: length 6.1
  Top Layer w0.254: U5.1 29.63,43.35 28.73,42.45 27.65,42.45 27.17,41.98 v1(27.17,40.9)
  Bottom Layer w0.254: FPC3.10 v1(27.17,40.9)
D12-LF_ENC_A: length 42.9
  Bottom Layer w0.381: FPC3.3 26.81,44.4 17.36,34.96 17.36,20.59 18.47,19.48 18.47,18.01 15.43,14.97 CN21.2
D13-LF_ENC_B: length 45.5
  Bottom Layer w0.381: CN21.1 18.04,12.43 19.17,13.56 19.17,36.08 26.99,43.9 FPC3.4
G2-ADVANCE_ALERT: length 51.9
  Top Layer w0.254: U4.9 61.15,30.56 R4.2 60.98,31.57 v1(61.01,31.59) ; 60.4,22.94 60.47,23 v1(60.47,25.35)
  Bottom Layer w0.254: v1(60.47,25.35) 61.01,25.89 v1(61.01,31.59) 61.01,35.74 53.27,43.47 28.41,43.47 FPC3.5
M0_1: length 8.6
  Top Layer w0.254: U17.8 30.34,24.13 U16.18
  Top Layer w0.508: U17.7 U17.8
M0_2: length 8.5
  Top Layer w0.254: U19.18 43.52,20.76 43.52,23.88 45.92,26.29 U20.7
  Top Layer w0.635: U20.7 U20.8
M1_1: length 10.2
  Top Layer w0.254: U16.22 27.75,24.22 26.82,25.15 24.84,25.15 23.75,26.24 U17.5
  Top Layer w0.508: U17.5 U17.6
M1_2: length 8.5
  Top Layer w0.254: U20.5 40.91,24.49 40.91,20.76
  Top Layer w0.635: U20.6 U20.5
NSLEEP1: length 14.4
  Top Layer w0.254: U18.2 20.98,32.4 21.71,31.67 21.71,27.22 25.15,23.78 25.15,20.76 U16.26
NSLEEP2: length 14.5
  Top Layer w0.381: U19.26 38.31,22.4 40.5,24.58 40.5,25.12 42.2,26.83 42.2,31.88 41.68,32.4 U21.2
VREF1: length 12.8
  Top Layer w0.254: U16.17 31,26.86 SW2.3
  Top Layer w0.381: R78.2 33.32,30.43 32.36,29.48 SW2.4 SW2.3
VREF2: length 17.2
  Top Layer w0.254: SW3.3 49.44,25.71 45.96,25.71 44.17,23.92 44.17,20.77 U19.17
  Top Layer w0.381: R83.2 53.46,30.43 51.97,28.94 51.97,26.97 SW3.4
  Top Layer w0.635: SW3.4 SW3.3
$1N2586: length 16.8
  Top Layer w0.254: v1(52.32,21.3) 64.12,21.3 65.58,22.76 65.58,22.97
  Bottom Layer w0.254: 51.2,20.42 51.49,20.72 52.32,20.72 ; 52.32,20.72 53.21,20.72 ; 52.32,20.72 52.32,20.72 v1(52.32,21.3)
$1N2757: length 2.6
  Bottom Layer w0.254: U3.5 52.99,22.05 Css1.1
$1N2774: length 4.3
  Bottom Layer w0.254: Cb1.2 55.99,23.06 54.98,22.05 54.98,20.82
$1N3335: length 2.3
  Bottom Layer w0.254: Cb1.1 57.39,21.37 U3.7
$1N3736: length 8.8
  Bottom Layer w0.254: 53.21,19.72 52.65,19.72 51.98,19.05 51.98,17.94 50.93,16.88 Rfb2.2
  Bottom Layer w0.635: Cff1.1 48.21,17.42 Rfb1.2 50.63,17.02 Rfb2.2
$1N3843: length 2.1
  Bottom Layer w0.254: U3.10 53.68,17.79 53.97,17.5 R2.1
$1N4403: length 7.5
  Top Layer w0.254: Rvl2.2 63.61,39.03 Rvl1.2 63.14,36.45 63.14,33.27 63.63,32.77 U4.6
$1N4455: length 12.5
  Top Layer w0.254: U4.12 v1(62.28,29.06) ; Rvl2.1 61.36,39.14 v1(61.36,38.09) 61.36,36.94 Rvl3.2
  Bottom Layer w0.254: v1(61.36,38.09) 62.28,37.18 v1(62.28,29.06)
$1N4604: length 2.2
  Top Layer w0.254: C1.1 61.9,30.06 U4.10
$1N5370: length 2.6
  Top Layer w0.254: 65.96,26.61 66.59,27.25 Q1.4
$1N5399: length 2
  Top Layer w0.254: 65.09,26.61 64.63,27.07 U4.15
$1N6333: length 1.9
  Top Layer w0.381: LED1.1 57.74,38.86 R67.1
$1N8396: length 6.4
  Top Layer w1.524: H3.2 7.1,29.9 CN15.2
$1N8453: length 6.4
  Top Layer w1.524: CN16.2 7.1,40.83 H4.2
$1N8892: length 12.3
  Bottom Layer w1.27: H5.2 54.84,49.62 60.09,54.87 CN9.1
$1N8949: length 12.3
  Bottom Layer w1.27: H6.2 39.08,50.11 44.33,55.36 CN10.1
$1N9008: length 12.3
  Bottom Layer w1.27: H7.2 23.32,49.73 28.57,54.98 CN11.1
$1N9072: length 12.3
  Bottom Layer w1.27: CN12.1 12.81,54.5 7.56,49.25 H8.2
$1N11133: length 5.7
  Top Layer w0.254: TP3.1 63.42,23.39 Rpg2.1 63.42,28.19 U4.13
$1N15353: length 5.5
  Top Layer w0.305: U5.7 33.45,42.67 38.58,42.67 L2.1
$1N15372: length 117.1
  Top Layer w0.254: CN12.3 5.81,55.53 R71.2
  Top Layer w0.305: 37.32,54.55 21.56,54.55 ; 37.32,54.55 37.33,54.55 CN10.3 ; 37.32,54.55 45.75,54.55 45.96,54.33 45.96,53.42 46.1,53.28 47.26,53.28 47.49,53.51 47.49,54.33 47.7,54.55 48.79,54.55 49.01,54.33 49.01,50.46 49.25,50.22 50.3,50.22 50.53,50.45 50.53,54.33 50.75,54.55 51.84,54.55 52.06,54.33 52.06,51.37 52.37,51.06 53.23,51.06 53.58,51.41 53.58,54.33 53.8,54.55 54.35,54.55 ; 21.56,54.55 9.58,54.55 CN12.3 ; 21.56,54.55 21.57,54.55 CN11.3 ; 54.35,54.55 54.89,54.55 55.11,54.33 55.11,53.81 55.32,53.6 56.41,53.6 56.63,53.81 56.63,54.33 56.84,54.55 57.94,54.55 60.77,51.71 60.77,48.29 57.08,44.59 54.08,44.59 ; 54.35,54.55 54.35,57.05 CN9.3 ; 54.08,44.59 C3.2 48.63,44.6 R69.2 43.52,44.6 41.95,43.03 L2.4 ; 54.08,44.59 D18.1
$1N15376: length 5.5
  Top Layer w0.305: L2.2 38.6,42.09 33.47,42.09 U5.6
$1N15395: length 117.1
  Top Layer w0.305: 18.04,62.14 18.07,62.11 CN11.4 ; 18.04,62.14 33.82,62.14 ; 18.04,62.14 6.13,62.14 CN12.4 2.31,54.93 R72.1 ; 33.82,62.14 33.83,62.13 CN10.4 ; 33.82,62.14 49.59,62.14 ; CN9.4 49.59,62.13 49.59,62.14 ; 49.59,62.14 60.77,62.14 63,59.91 63,47.28 55.71,39.99 C4.1 R70.1 43.85,39.99 L2.3 ; D19.2 54.08,39.99
$1N21136: length 2.8
  Top Layer w0.254: U4.8 62.09,31.06 61.67,31.49 61.67,32.84
$2N537: length 1.5
  Top Layer w0.254: Ccp1.1 22.92,14.1 U16.1
$2N882: length 2.5
  Top Layer w0.381: U16.28 23.69,20.91 23.69,22.67 23.34,23.02
$2N887: length 2.3
  Top Layer w0.381: Css2.2 24.5,22.96 U16.27
$2N1421: length 6.7
  Top Layer w0.254: U16.16 31.65,23.32 R77.1 32.81,25.12 33.59,25.9 TP4.1
$2N1750: length 2.2
  Top Layer w0.254: 32.36,36.74 R79.1 ; 32.36,36.68 SW2.1
$2N1806: length 2.1
  Top Layer w0.254: 30.94,34.72 R80.2
$2N2402: length 5.4
  Top Layer w0.381: LED2.1 20.37,25.7 20.37,30.52 U18.1
$2N3185: length 2.3
  Top Layer w0.381: U19.27 37.66,22.9 Css3.2
$2N3192: length 2.4
  Top Layer w0.381: U19.28 37.01,22.7 Css3.1
$2N3198: length 8.7
  Top Layer w0.254: TP5.1 48.21,25.35 46.15,25.35 45.69,24.89 R82.1
  Top Layer w0.381: R82.1 44.81,23.62 U19.16
$2N3201: length 1.7
  Top Layer w0.381: 35.77,13.9 35.89,13.9 U19.1
$2N3394: length 2.3
  Top Layer w0.381: SW3.2 50.68,36.63 R85.2
$2N3396: length 2.2
  Top Layer w0.381: SW3.1 51.95,36.7 R84.1
$2N3655: length 1.4
  Top Layer w0.381: 38.75,25.65 R86.2
$2N6611: length 1.8
  Top Layer w0.381: 17.54,25.65 LED2.2
$2N6716: length 5.9
  Top Layer w0.381: U21.1 40.99,30.6 40.99,27.88 39.82,26.72 LED3.1

## Copper pours and planes (outline as drawn; the poured copper is in the pictures)
3V3 on Bottom Layer: 27.58,38.61 31.62,38.61 31.62,37.54 27.58,37.54
5V on Bottom Layer: 27.53,37.65 34.43,37.65 34.43,35.58 27.53,35.58
8V4 on Bottom Layer: 39.62,34.24 56.96,34.24 56.96,29.42 39.62,29.42
8V4 on SIG: 68.11,49.74 73.93,49.74 73.93,46.5 68.11,46.5
8V4 on PWR: 0.26,66.08 82.89,66.08 82.89,29.3 0.26,29.3
GND on Top Layer: 23.88,19.48 32.08,19.48 32.08,16.39 23.88,16.39
GND on Top Layer: 62.48,33.32 62.48,34.79 62.22,35.05 60.65,35.05 60.4,35.3 60.4,37.79 59.79,38.4 56.79,38.4 56.79,28.19 60.19,28.19 60.5,28.49 60.5,32.83 60.96,33.29 60.96,33.32
GND on Top Layer: -7.94,69.17 85.67,69.17 85.67,-4.56 -7.94,-4.56
GND on Top Layer: 37.29,19.48 44.78,19.48 44.78,16.29 37.29,16.29
GND on Top Layer: 48.02,23.07 52.44,23.07 52.44,17.88 48.02,17.88
GND on Bottom Layer: 49.14,19.65 51.68,19.65 51.68,17.88 49.14,17.88
GND on Bottom Layer: 54.02,20.68 54.02,18.29 54.27,18.04 54.68,18.04 55.54,17.17 55.54,16.46 56.51,15.5 67.83,15.5 67.83,18.6 67.78,18.65 56.76,18.65 56.15,18.04 55.15,18.04 54.77,18.42 54.77,20.43 54.52,20.68
GND on Bottom Layer: -5.46,67.35 93.21,67.35 93.21,-11.79 -5.46,-11.79
GND on Bottom Layer: 79.03,48.47 82.6,48.47 82.6,44.19 79.03,44.19
GND on Bottom Layer: 27.43,35.62 30.66,35.62 30.66,33.46 27.43,33.46
GND on Bottom Layer: 48.58,23.17 50.77,23.17 50.77,21 48.58,21
GND on Bottom Layer: 52.45,16.11 52.2,15.86 52.2,14.83 52.49,14.53 54.78,14.53 55.74,15.5 56.76,15.5 56.87,15.61 56.87,18.19 56.34,18.19 54.63,16.66 54.63,16.11
GND on Bottom Layer: 48.73,28.6 48.73,25.35 45.08,21.7 45.08,15.8 48.02,12.86 54.42,12.86 56.86,15.29 56.86,18.65 56.91,18.7 67.78,18.7 67.89,18.6 67.89,10.57 35.83,10.57 35.83,28.6
GND on SIG: 32.38,23.58 32.54,23.73 34.76,23.73 35.42,23.07 35.42,12.3 35.22,12.09 32.54,12.09 32.38,12.24
GND on SIG: 64.41,27.98 64.41,31.49 64.88,31.96 64.88,39.81 64.26,40.43 57.25,40.43 56.64,39.82 56.64,28.24 57.04,27.83 64.26,27.83
GND on SIG: 44.58,22.01 47.62,22.01 47.62,11.89 44.58,11.89
GND on SIG: 53.05,22.81 52.29,23.57 48.43,23.57 47.77,22.91 47.77,15.5 48.89,14.38 54.52,14.38 55.39,15.24 55.39,16.72 54.6,17.5 53.06,17.5 53.05,17.52
GND on SIG: -2.02,65.73 85.82,65.73 85.82,-3.34 -2.02,-3.34
VCC on Top Layer: 31.98,16.08 31.98,14.06 32.43,13.68 32.43,11.23 30.82,11.23 30.82,13.73 31.31,14.04 31.31,16.08
VCC on Top Layer: 67.53,21.59 76.67,21.59 76.67,15.8 67.53,15.8
VCC on Top Layer: 48.75,17.02 52.12,17.02 52.12,12.9 48.75,12.9
VCC on Top Layer: 44.58,15.99 45.09,15.99 45.09,14.17 45.64,13.61 45.64,11.49 43.97,11.49 43.97,13.61 44.58,14.22
VCC on Top Layer: 24.74,16.12 24.74,11.23 24.54,11.03 18.47,11.03 17.15,12.35 17.15,16.6 18.12,17.56 20.09,17.56 21.2,16.44 21.2,13.46 21.4,13.26 23.58,13.26 24.14,13.81 24.14,16.12
VCC on Top Layer: 37.39,15.94 38,15.94 38,11.59 37.7,11.28 35.57,11.28 35.27,11.59 35.27,13.16 35.37,13.26 36.23,13.26 37.39,14.42
VCC on Bottom Layer: 59.71,21.49 58.95,20.73 55.59,20.73 55.19,20.32 55.19,18.29 55.29,18.19 55.89,18.19 56.3,18.6 68.14,18.6 69.36,17.38 73.63,17.38 73.63,21.49
VCC on SIG: 5.72,25.65 14.17,25.65 14.17,20.59 5.72,20.59
VCC on SIG: 16.09,52.62 23.43,52.62 23.43,49.69 16.09,49.69
VCC on PWR: 0.26,34.58 82.89,34.58 82.89,0.26 0.26,0.26
BAT_VCC on Top Layer: 69.52,42.65 65.62,42.65 64.79,41.81 64.79,31.7 64.74,31.65 64.74,28.96 64.79,28.91 66.21,28.91 66.26,28.96 66.26,31.75 66.9,32.39 81.68,32.39 82.62,33.33 82.62,41.76 81.7,42.68 69.55,42.68
BAT_VCC on Bottom Layer: 73.47,42.98 82.78,42.98 82.78,34.71 73.47,34.71
FUSED_VCC on Top Layer: 69.66,31.81 74.74,31.81 74.74,21.8 69.66,21.8
$1N2774 on Bottom Layer: 54.68,19.76 54.68,21.32 52.19,23.78 52.19,26.42 56.4,26.42 56.4,22.96 55.24,21.8 55.24,19.76
$1N5506 on Top Layer: 65.37,28.85 65.37,27.78 65.43,27.73 69.22,27.73 69.37,27.88 69.37,31.56 69.12,31.81 66.41,31.81 66.34,31.74 66.34,28.9 66.29,28.85
$1N6888 on Top Layer: 43.17,43.69 46.37,43.69 46.37,40.98 43.17,40.98
$1N7703 on Top Layer: 1.82,54.14 5.82,54.14 5.82,52.5 5.65,52.33 3.98,52.33 3.75,52.1 3.75,50.91 3.59,50.75 2.18,50.75 1.82,51.1

Small or netless copper shapes (teardrops, artwork), in the pictures only: 250 on Top Layer, 73 on Bottom Layer, 73 on SIG, 36 on PWR

## Text on the board
Bottom Silkscreen Layer: .1 | .2 | !!! | Hi / -Z | A | 12->MODE1|34->MODE0 | 0|1->1 | 1|1 | 1|0->0 | 0|0-> | 1|0 | 0|1 | X | I2C | DA|CL|5V|G | 1 | 2 | DR|ST | Vref | MODE | A+ | A- | B+ | B- | B | 总线Servo | @Yuyu--V3.1 | CAN总线 | ENC | SIG|V|GND | CANL|CANH|GND|V | V | G | LF | 5
Top Silkscreen Layer: A | B | Vref | 12V_IN | 24V_IN | B|A|G|5V | VCC|8V4 | DIR | STEP | 跳线帽电压选择 | ON | VCC | 8V4 | G|V|SIG | MODE | 1 | 0 | PWR | <-SAME | G|5V|CL|DA | V | I2C | ENC | A+ | A- | B+ | B- | GND | RF | 总线Servo | 24-12V | Vcc | OFF | CAN总线-> | V|GND|CANH|CANL | -> | 1234 | 12 | ALERT|BUCK-PG | FUSE-PG
